# EasyEDA Pro project modular_design.eprj, board log
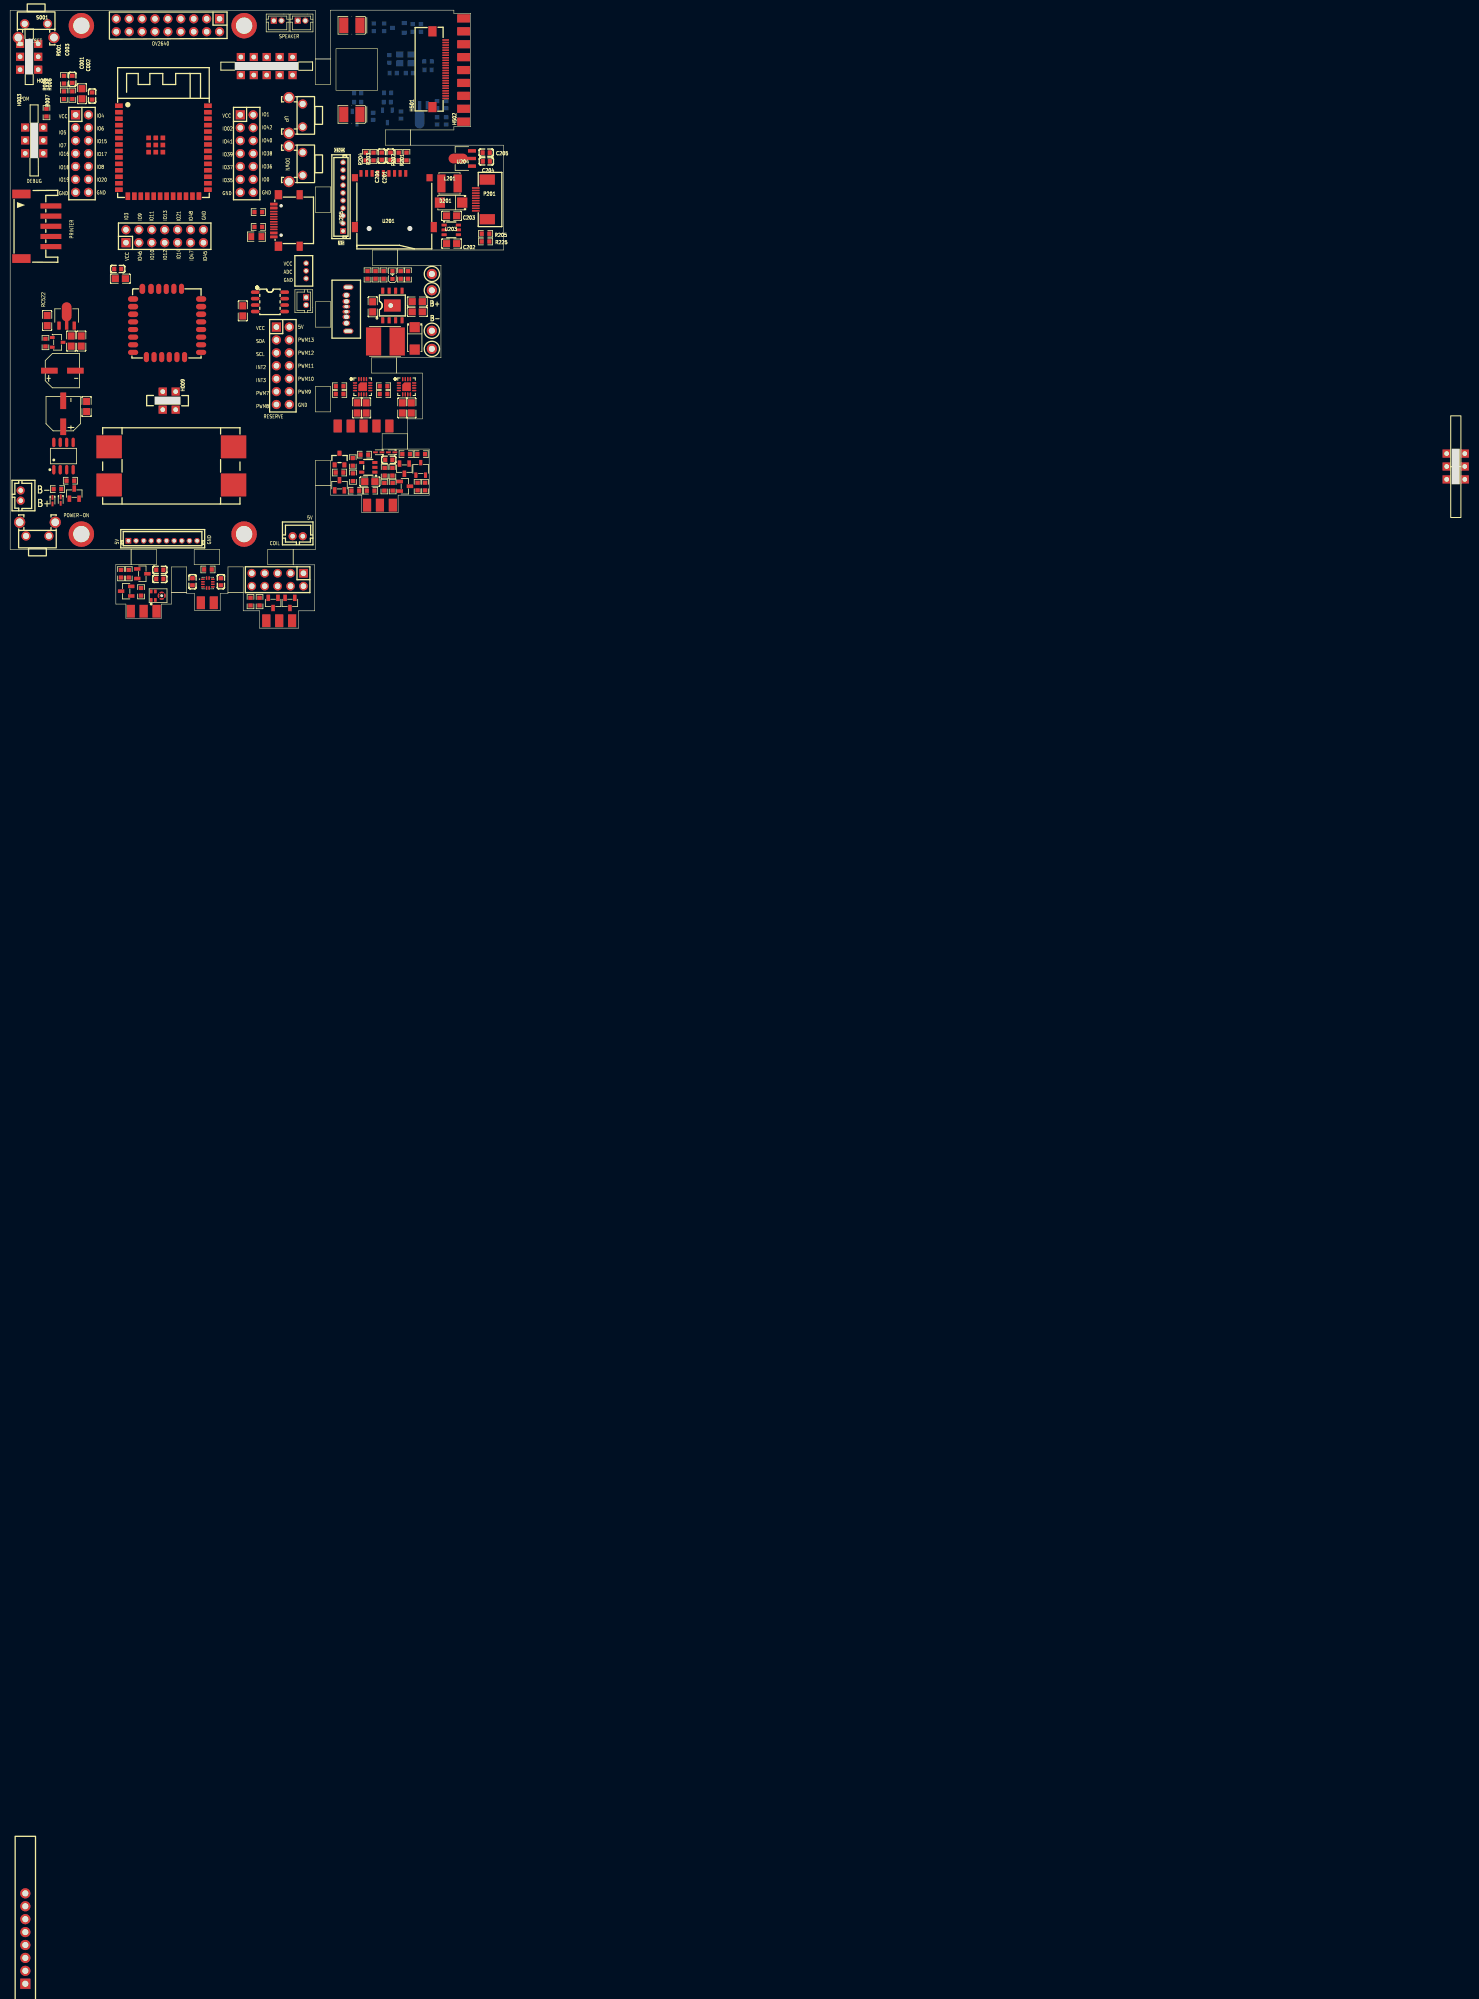
[diagram p9: board, top side]
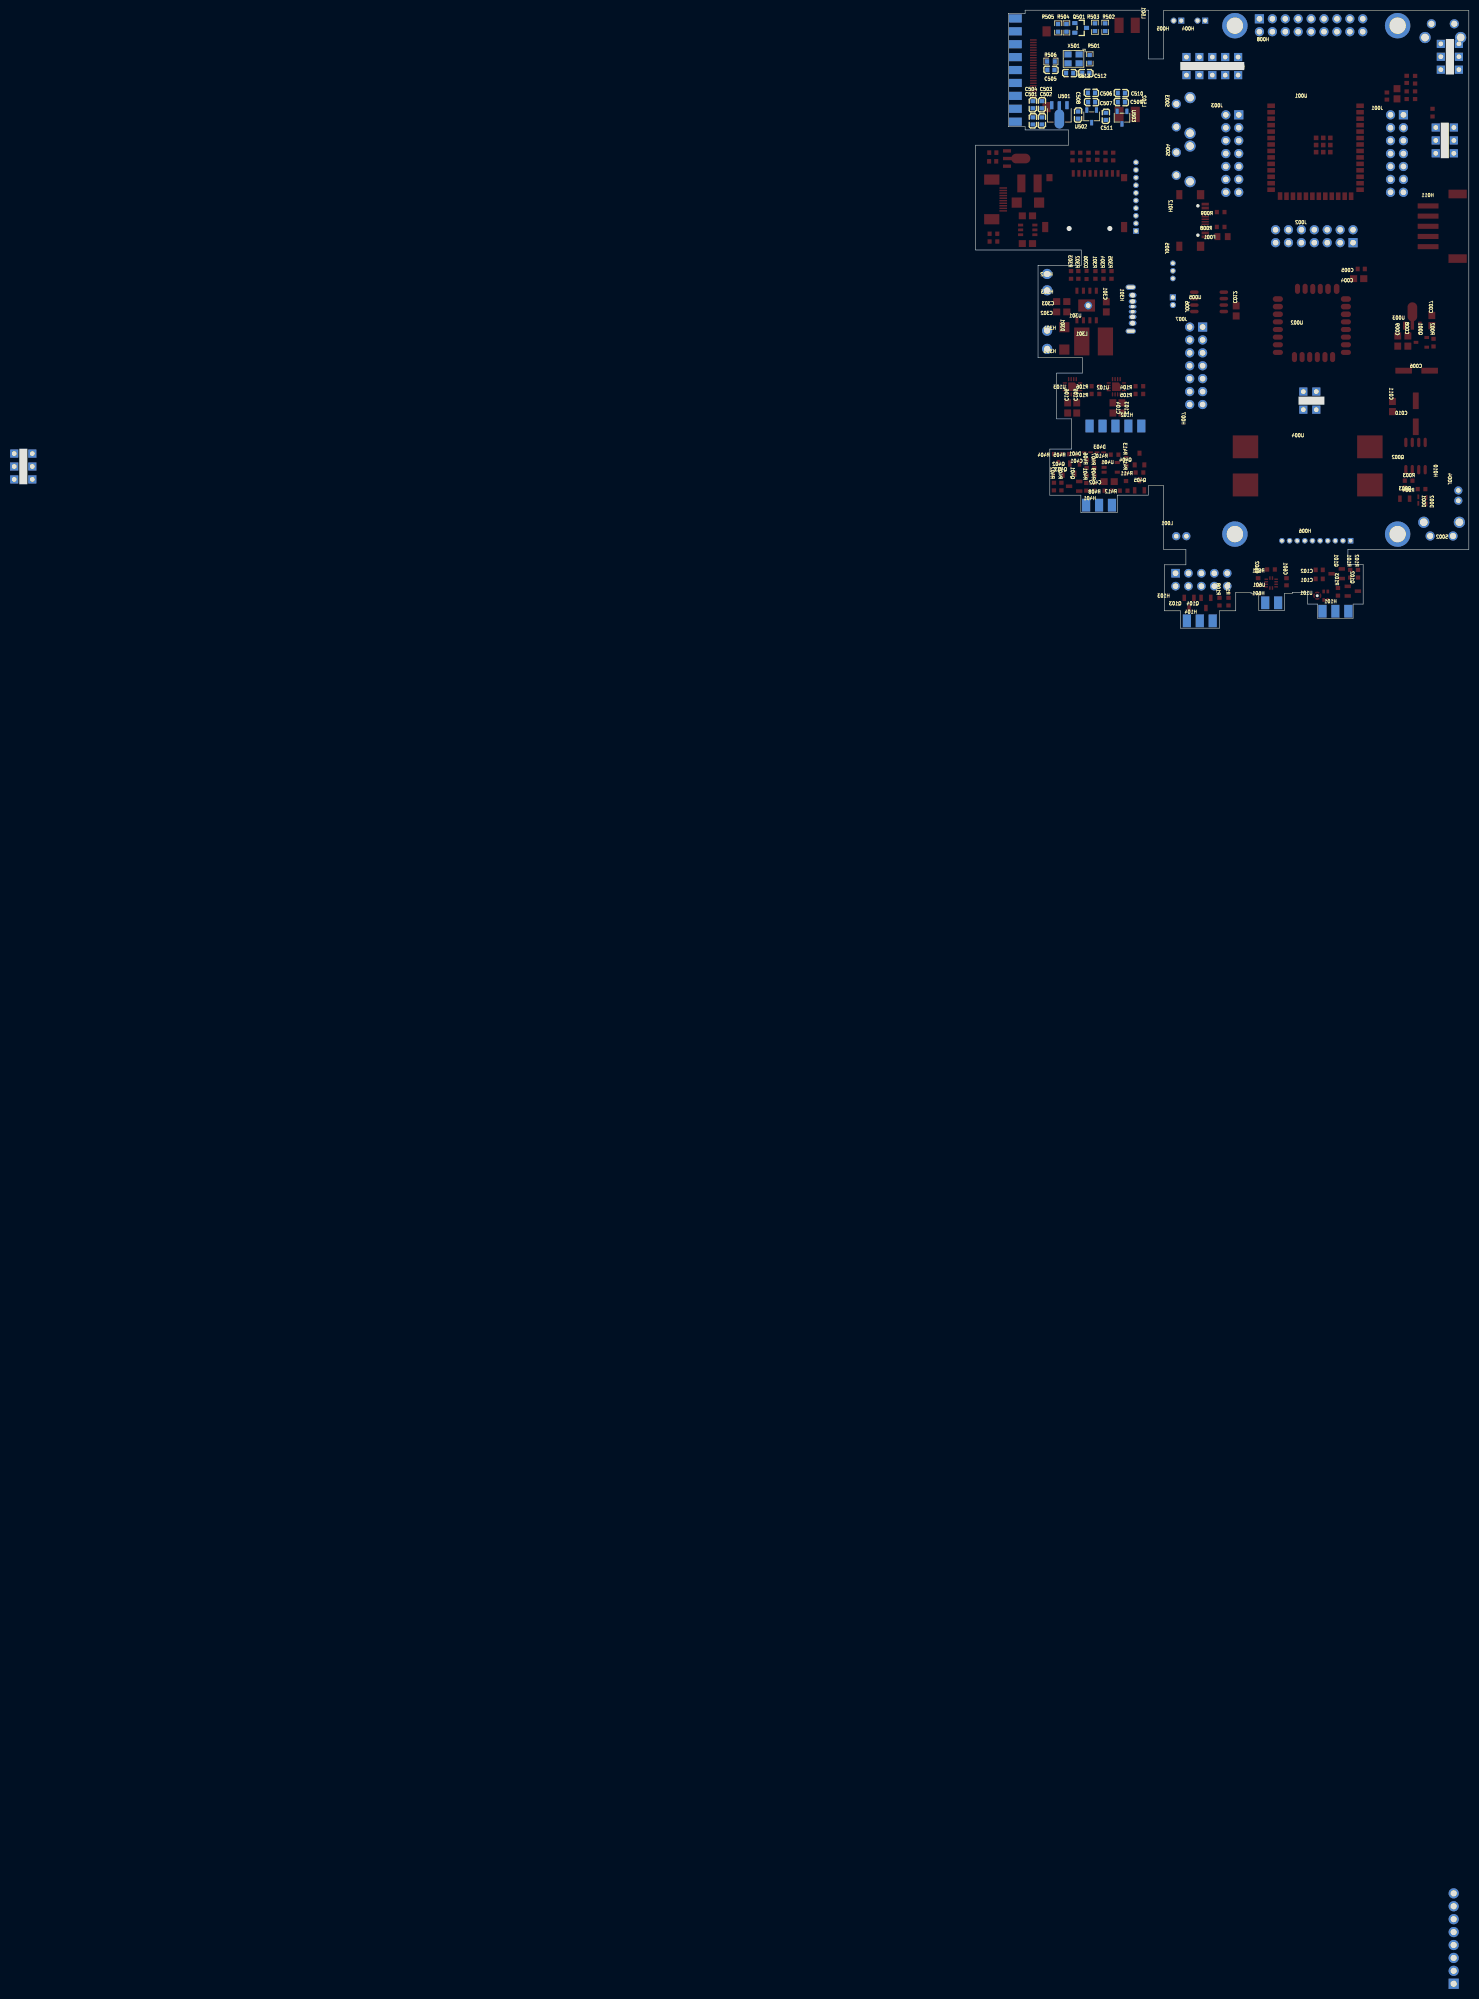
[diagram p10: board, bottom side, seen from below]

Outline 285.05 x 121.54 mm; copper layers: Top Layer, Bottom Layer. Coordinates in mm from the lower left corner of the outline.
Outline path: 0,121.49 60,121.49 60,111.94 62.99,111.94 62.99,121.52 63.01,121.54 87.25,121.54 87.25,120.91 90.56,120.91 90.56,98.63 87.25,98.63 87.25,97.99 78.76,97.99 78.76,94.99 96.99,94.99 96.99,74.37 76.22,74.37 76.22,71.37 84.71,71.37 84.71,53.18 76,53.18 76,50.16 81.05,50.16 81.05,41.15 78.12,41.15 78.12,35.22 82.39,35.22 82.39,26.15 76.29,26.15 76.29,22.75 69.14,22.75 69.14,26.16 63.03,26.16 63.03,28 60.02,28 60.02,15.47 55.64,15.47 55.64,12.45 59.89,12.45 59.89,3.42 59.87,3.4 56.73,3.4 56.73,0 49.04,0 49.04,3.4 45.83,3.4 45.83,7.04 42.83,7.04 42.83,6.84 41.3,6.84 41.3,3.5 36.23,3.5 36.23,6.84 34.71,6.84 34.71,7.04 31.7,7.04 31.7,4.73 29.73,4.73 29.73,1.93 22.76,1.93 22.76,4.73 20.78,4.73 20.78,12.49 23.78,12.49 23.78,15.49 0,15.49 0,121.49
Stack: Top Layer 0.035mm / Dielectric1 1.51mm FR4 er 4.5 / Bottom Layer 0.035mm

## Design rules (mm)
template: 自定义配置
spacing copperThickness1oz (default): track to track 0.102, other pairs 0.05 to 0.3
track width copperThickness1oz (default): min 0.127, default 0.254, max 2.54
track width copperThickness2oz: min 0.203, default 0.254, max 2.54
differential pair differentialPair (default): width min 0.127, default 0.254, max 2.54; gap min 0.152, default 0.152
via viaSize (default): diameter min 0.5, default 0.5, max 10; hole min 0.3, default 0.3, max 6.3

## Placement (name value [footprint] x y rotation side)
C001  10uF  [C0805]  14.12 105.1 90 top
C002  100nF  [C0603]  16.11 104.65 90 top
C003  100nF  [C0603]  12.22 107.93 90 top
C004  10uF  [C0805]  21.66 68.73 0 top
C005  100nF  [C0603]  21.15 70.64 0 top
C006  100uF  [CAP-SMD_BD6.3-L6.6-W6.6-LS7.2-R-RD]  10.26 50.64 180 top
C007  100nF  [C0805]  7.27 60.49 90 top
C008  10uF  [C0805]  11.99 56.46 90 top
C009  100nF  [C0805]  13.98 56.46 90 top
C010  100uF  [CAP-SMD_BD6.3-L6.6-W6.6-LS7.2-R-RD]  10.43 42.16 270 top
C011  100nF  [C0805]  15.02 43.58 270 top
C012  10uF  [C0805]  45.75 62.4 90 top
C101  -  [C0603]  29.42 9.68 180 top
C102  100nF  [C0603]  29.42 11.46 180 top
C103  100nF  [C0805]  68.22 43.31 90 top
C104  -  [C0805]  70 43.31 90 top
C105  100nF  [C0805]  77.11 43.31 90 top
C106  -  [C0805]  78.89 43.31 90 top
C201  -  [C0603]  74.79 92.81 270 top
C202  -  [C0805]  86.8 75.64 0 top
C203  -  [C0805]  86.8 81.09 0 top
C204  -  [C0603]  93.63 91.81 180 top
C205  -  [C0603]  93.61 93.52 180 top
C206  100nF  [C0603]  73.07 92.81 270 top
C301  10uF  [C0805]  71.29 63.19 90 top
C302  22uF  [C0805]  80.05 62.19 0 top
C303  100uF  [C0805]  80.05 64.23 0 top
C401  1uF  [C0603]  74.45 33.1 0 top
C402  -  [C0805]  70.73 28.82 180 top
C501  100nF  [C0603]  85.73 99.77 270 bottom
C502  10uF  [C0603]  83.95 99.77 270 bottom
C503  10uF  [C0603]  83.95 102.94 90 bottom
C504  100nF  [C0603]  85.73 102.94 90 bottom
C505  -  [C0603]  82.17 109.8 0 bottom
C506  -  [C0603]  74.21 105.29 180 bottom
C507  -  [C0603]  74.17 103.45 180 bottom
C508  -  [C0603]  76.84 100.91 270 bottom
C509  10UF  [C0603]  68.33 103.45 180 bottom
C510  -  [C0603]  68.33 105.23 180 bottom
C511  -  [C0603]  71.38 100.66 270 bottom
C512  100nF  [C0603]  75.32 109.17 0 bottom
C513  20pF  [C0603]  78.49 109.17 0 bottom
C601  104  [C0603]  35.85 9.12 270 top
C602  104  [C0603]  41.44 9.12 270 top
D001  1N4148WT  [SOD-523_L1.2-W0.8-LS1.6-RD]  9.93 25.19 270 top
D002  1N4148WT  [SOD-523_L1.2-W0.8-LS1.6-RD]  8.32 25.06 270 top
D201  SS14  [SMA_L4.3-W2.6-LS5.2-RD]  86.7 83.69 180 top
D206  LED_0603-R  [LED_0603]  75.16 69.52 90 top
D301  SS34A  [SMA_L4.3-W2.6-LS5.2-RD]  79.55 56.99 270 top
D401  1N4148WT  [SOD-523_L1.2-W0.8-LS1.6-RD]  75.01 34.58 180 top
D403  1N4148WT  [SOD-523_L1.2-W0.8-LS1.6-RD]  72.46 34.58 180 top
F001  -  [R0805]  48.41 77 0 top
H001  PZ254V-12-6P  [PDM_MODULE]  4.73 108.88 180 top
H002  -  [I2S_HT517_STEREO]  50.45 110.53 90 top
H003  PZ254V-12-6P  [CH343_DEBUG]  4.73 95.92 0 top
H004  B2B-ZR(LF)(SN)  [CONN-TH_B2B-ZR-LF-SN]  52.6 119.48 180 top
H005  B2B-ZR(LF)(SN)  [CONN-TH_B2B-ZR-LF-SN]  57.3 119.48 180 top
H006  -  [connector_p10_1.5mm]  30 17.18 0 top
H007  -  [Metal_Detect]  55.78 31.79 180 top
H008  -  [connector_p2*9_2.54]  30 118.57 180 top
H009  A2541HWV-2x2P  [SC7A20_MODULE]  30 44.74 270 top
H010  -  [RFID_RC522]  4.98 29.76 90 top
H011  HX20007-5AWB  [CONN-SMD_5P-P2.00_HX20007-5AWB]  5.11 79.03 270 top
H012  TYPEC-304S-ACP16  [USB-C-SMD_TYPEC-304S-ACP16]  54.38 80.18 90 top
H101  PZ254V-12-6P  [Finger_2*3]  23.7 3.33 0 top
H102  -  [Finger_2*5]  66.95 39.76 0 top
H103  MTP125-1205S1  [HDR-TH_10P-P2.54-V-M-R2-C5-S2.54]  52.59 9.53 180 top
H104  PZ254V-12-6P  [Finger_2*3]  50.36 1.45 0 top
H301  -  [typec-31-e-11]  66.09 62.73 90 top
H302  -  [Single_Pin]  82.92 69.66 0 top
H303  -  [Single_Pin]  82.92 66.44 0 top
H304  -  [Single_Pin]  82.92 58.49 0 top
H305  -  [Single_Pin]  82.92 54.92 0 top
H401  PZ254V-12-6P  [Finger_2*3]  70.17 24.19 0 top
H501  AFC01-S24FCA-00  [FPC-SMD_P0.50-24P_FGS-XJ-H2.0]  84.33 109.93 90 top
H502  -  [Finger_2*9]  89.16 104.69 90 top
H601  A2541HWV-2x2P  [Finger_2*2]  37.5 4.98 0 top
J001  2.54-2*7P母  [HDR-TH_14P-P2.54-V-F-R2-C7-S2.54-1]  14.13 93.34 270 top
J002  2.54-2*7P母  [HDR-TH_14P-P2.54-V-F-R2-C7-S2.54-1]  30.39 77.08 0 top
J003  2.54-2*7P母  [HDR-TH_14P-P2.54-V-F-R2-C7-S2.54-1]  46.51 93.34 270 top
J004  B2B-ZR(LF)(SN)  [connector_p2_2.0mm]  2.06 26.07 270 top
J005  -  [conn-dip-1*3-1.5mm]  58.19 70.27 270 top
J006  B2B-ZR(LF)(SN)  [CONN-TH_B2B-ZR-LF-SN]  58.19 64.3 90 top
J007  2.54-2*7P母  [HDR-TH_14P-P2.54-V-F-R2-C7-S2.54-1]  53.62 51.6 270 top
L001  -  [connector_p2_2.0mm]  56.54 18.07 0 top
L201  22uH  [IND-SMD_L4.0-W4.0]  86.39 87.47 180 top
L301  -  [IND-SMD_L5.8-W5.2]  73.79 56.38 0 top
L501  暖白3528LED灯珠  [LED-SMD_L3.6-W2.9-R-RD]  67.19 118.56 180 top
L502  暖白3528LED灯珠  [LED-SMD_L3.6-W2.9-R-RD]  67.19 101.04 180 top
NOREF  -  [Pad_e2609]  74.83 63.45 90 top
NOREF#2  -  [Pad_e164]  46 18.49 90 top
NOREF#3  -  [Pad_e162]  46 118.49 180 top
NOREF#4  -  [Pad_e160]  14 118.49 0 top
NOREF#5  -  [Pad_e163]  14 18.49 0 top
P201  0.5-10P上接  [FPC_0.5_10P_mirror]  93.81 84.3 90 top
Q001  SS8550  [SOT-23-3_L2.9-W1.4-P1.90-LS2.6-BR]  9.34 56.21 180 top
Q002  AO4407C  [SOP-8_L4.9-W3.9-P1.27-LS6.0-BL]  10.48 33.84 0 top
Q003  SS8050  [SOT-23-3_L2.9-W1.3-P1.90-LS2.4-BR]  12.6 26.46 270 top
Q101  AO3407  [SOT-23-3_L2.9-W1.3-P1.90-LS2.4-BR]  25.99 10.7 180 top
Q102  SS8050  [SOT-23-3_L2.9-W1.3-P1.90-LS2.4-BR]  22.81 7.27 0 top
Q103  SS8050  [SOT-23-3_L2.9-W1.3-P1.90-LS2.4-BR]  55.01 4.95 90 top
Q104  SS8050  [SOT-23-3_L2.9-W1.3-P1.90-LS2.4-BR]  51.7 4.95 90 top
Q401  MMBT3904  [SOT-23-3_L2.9-W1.3-P1.90-LS2.4-BR]  77.61 27.9 180 top
Q402  MMBT3906-7-F  [SOT-23-3_L2.9-W1.6-P1.90-LS2.8-BR]  80.72 31.32 270 top
Q403  AO3402A  [SOT-23-3_L2.9-W1.3-P1.90-LS2.4-BR]  77.51 31.37 90 top
Q404  AO3401A  [SOT-23_L2.9-W1.3-P1.90-LS2.4-BR]  64.76 33.25 270 top
Q405  MMBT3904  [SOT-23-3_L2.9-W1.3-P1.90-LS2.4-BR]  64.76 28.1 270 top
Q501  AO3404A  [SOT-23_L2.9-W1.3-P1.90-LS2.4-BR]  76.33 118.06 0 bottom
R001  10K  [R0603]  10.57 107.86 270 top
R002  -  [R0603]  6.94 56.16 90 top
R003  10K  [R0603]  11.84 29 180 top
R004  -  [R0603]  9.3 27.34 180 top
R005  10K  [R0603]  10.57 104.81 90 top
R006  10K  [R0603]  12.22 104.81 90 top
R007  10K  [R0603]  7.14 101.39 90 top
R008  -  [R0603]  48.8 78.91 0 top
R009  -  [R0603]  48.8 81.83 0 top
R101  10K  [R0603]  23.32 10.7 270 top
R102  10R  [R0603]  21.8 10.7 90 top
R103  1K  [R0603]  25.73 7.14 90 top
R104  NC  [R0603]  64.79 47.58 180 top
R105  NC  [R0603]  64.79 46.05 180 top
R106  NC  [R0603]  73.42 47.58 180 top
R107  NC  [R0603]  73.42 46.05 180 top
R108  -  [R0603]  49.04 5.21 270 top
R109  -  [R0603]  47.26 5.21 270 top
R201  10K  [R0603]  77.93 92.76 270 top
R202  10K  [R0603]  76.41 92.76 90 top
R203  10K  [R0603]  71.45 92.76 90 top
R204  10K  [R0603]  69.93 92.76 90 top
R205  -  [R0603]  93.48 77.57 180 top
R225  -  [R0603]  93.48 76.04 180 top
R301  1K  [R0603]  73.43 69.47 270 top
R302  10K  [R0603]  76.8 69.47 270 top
R303  10K  [R0603]  78.22 69.47 270 top
R304  -  [R0603]  71.85 69.47 270 top
R305  -  [R0603]  70.27 69.47 270 top
R401  -  [R0603]  75.22 27.8 90 top
R402  -  [R0603]  81.59 27.85 90 top
R403  -  [R0603]  80.11 27.85 90 top
R404  -  [R0603]  80.83 34.22 0 top
R405  -  [R0603]  77.87 34.22 0 top
R406  -  [R0603]  73.64 30.76 90 top
R407  -  [R0603]  75.17 30.76 270 top
R408  -  [R0603]  70.88 27.03 0 top
R409  -  [R0603]  73.58 27.8 270 top
R410  -  [R0603]  69.66 34.12 0 top
R411  10K  [R0603]  64.76 30.6 180 top
R412  -  [R0603]  67.87 27.03 180 top
R413  -  [R0603]  67.36 32.69 90 top
R414  -  [R0603]  67.41 29.68 90 top
R501  1K  [R0603]  74.55 111.96 270 bottom
R502  -  [R0603]  71.51 118.18 90 bottom
R503  -  [R0603]  73.54 118.18 270 bottom
R504  -  [R0603]  79.13 118.06 90 bottom
R505  -  [R0603]  80.78 118.06 270 bottom
R506  -  [R0603]  82.17 111.45 180 bottom
R601  -  [R0603]  38.9 11.53 180 top
S001  TC-1102N-C-A-B  [SW-TH_TC-1102N-C-A-B]  5.11 117.51 180 top
S002  TC-1102N-C-A-B  [SW-TH_TC-1102N-C-A-B]  5.36 19.47 0 top
S003  TC-1102N-C-A-B  [SW-TH_TC-1102N-C-A-B]  56.17 100.84 90 top
S004  TC-1102N-C-A-B  [SW-TH_TC-1102N-C-A-B]  56.17 91.32 90 top
U001  -  [ESP32-S3-WROOM-1U]  30.26 93.85 0 top
U002  -  [GPBA02B-C]  32.03 59.73 0 top
U003  ME6206A33PG  [SOT-89-3_L4.5-W2.5-P1.50-LS4.2-BR]  11.1 60.85 270 top
U004  -  [CX8823_MO]  18.19 39.41 0 top
U005  -  [sop-8_l5.0-w4.0-p1.27-ls6.2-bl]  51.08 64.17 270 top
U101  -  [SD18OB261-104]  28.4 6.38 0 top
U102  HT517  [QFN-16_L3.0-W3.0-P0.50-TL-EP1.7]  69.31 47.48 0 top
U103  HT517  [QFN-16_L3.0-W3.0-P0.50-TL-EP1.7]  77.94 47.48 0 top
U201  -  [TF-01A]  75.54 82.27 0 top
U203  MT9201  [SOT-23-6_L2.9-W1.6-P0.95-LS2.8-BR]  86.74 78.33 180 top
U204  ME6206A33PG  [SOT-89-3_L4.5-W2.5-P1.50-LS4.2-BR]  89.45 92.36 0 top
U205  -  [connector_p10_1.5mm]  65.46 84.86 90 top
U301  CS5095E  [ESOP-8_L4.9-W3.9-P1.27-LS6.0-BL-EP]  75.16 63.45 0 top
U401  LM321-TR  [SOT-23-5_L3.0-W1.7-P0.95-LS2.8-BR]  70.42 31.62 0 top
U501  ME6206A33PG  [SOT-89-3_L4.5-W2.5-P1.50-LS4.2-BR]  80.52 101.49 90 bottom
U502  XC6206-2.8V  [SOT-23-3_L2.9-W1.6-P1.90-LS2.8-BR]  74.17 100.66 90 bottom
U503  XC6206-1.2V  [SOT-23-3_L2.9-W1.6-P1.90-LS2.8-BR]  68.2 100.4 90 bottom
U601  -  [LGA-12_L2.0-W2.0-P0.50-TL]  38.9 8.87 0 top
X501  24MHz  [OSC-SMD_4P-L3.2-W2.5-BL]  77.73 111.96 0 bottom

## Footprints (pads in the part's own frame, mm; a bottom-side part is the same pattern mirrored in y, then rotated)
C0603
  rect 0.8x0.9 smd: 1(-0.7,0) 2(0.7,0)
C0805
  rect 1.41x1.35 smd: 1(-1,0) 2(1,0)
CAP-SMD_BD6.3-L6.6-W6.6-LS7.2-R-RD
  rect 3.26x1.15 smd: 1(2.555,0) 2(-2.555,0)
CH343_DEBUG
  rect 1.6x1.6 hole 0.914: 1(-1.778,2.54) 2(1.778,2.54) 3(-1.778,0) 4(1.778,0) 5(-1.778,-2.54) 6(1.778,-2.54)
conn-dip-1*3-1.5mm
  round 1.1 hole 0.701: 1(-1.498,0) 2(0,0) 3(1.498,0)
CONN-SMD_5P-P2.00_HX20007-5AWB
  rect 1.001x4.099 smd: 1(-4,2.901) 2(-1.999,2.901) 3(0,2.901) 4(1.999,2.901) 5(4,2.901)
  rect 1.7x3.599 smd: 6(6.35,-2.901) 7(-6.35,-2.901)
CONN-TH_B2B-ZR-LF-SN
  rect 1.2x1.2 hole 0.8: 1(0.75,0.001)
  round 1.2 hole 0.8: 2(-0.75,-0.001)
connector_p2*9_2.54
  rect 1.801x1.801 hole 1.1: 1(-11.176,-1.27)
  round 1.801 hole 1.1: 2(-11.176,1.27) 3(-8.636,-1.27) 4(-8.636,1.27) 5(-6.096,-1.27) 6(-6.096,1.27) 7(-3.556,-1.27) 8(-3.556,1.27) 9(-1.016,-1.27) 10(-1.016,1.27) 11(1.524,-1.27) 12(1.524,1.27) 13(4.064,-1.27) 14(4.064,1.27) 15(6.604,-1.27) 16(6.604,1.27) 17(9.144,-1.27) 18(9.144,1.27)
connector_p2_2.0mm
  round 1.6 hole 0.899: 1(1.001,0.004) 2(-1.001,0.004)
connector_p10_1.5mm
  rect 1.1x1.1 hole 0.701: 1(-6.749,0.001)
  round 1.1 hole 0.701: 2(-5.25,0.001) 3(-3.749,0.001) 4(-2.251,0.001) 5(-0.75,0.001) 6(0.75,0.001) 7(2.251,0.001) 8(3.749,0.001) 9(5.25,0.001) 10(6.752,0.001)
CX8823_MO
  rect 5x4.5 smd: 1(1.27,-3.75) 2(25.73,-3.75) 3(1.27,-11.25) 4(25.73,-11.25)
ESOP-8_L4.9-W3.9-P1.27-LS6.0-BL-EP
  rect 0.6x1.2 smd: 1(-1.905,-2.909) 2(-0.635,-2.909) 3(0.635,-2.909) 4(1.905,-2.909) 5(1.905,2.909) 6(0.635,2.909) 7(-0.635,2.909) 8(-1.905,2.909)
  rect 3.3x2.4 smd: 9(0,0)
ESP32-S3-WROOM-1U
  rect 1.5x0.9 smd: 1(-8.877,8.895) 2(-8.877,7.625) 3(-8.877,6.355) 4(-8.877,5.085) 5(-8.877,3.815) 6(-8.877,2.545) 7(-8.877,1.275) 8(-8.877,0.005) 9(-8.877,-1.265) 10(-8.877,-2.535) 11(-8.877,-3.805) 12(-8.877,-5.075) 13(-8.877,-6.345) 14(-8.877,-7.615) 27(8.623,-7.615) 28(8.623,-6.345) 29(8.623,-5.075) 30(8.623,-3.805) 31(8.623,-2.535) 32(8.623,-1.265) 33(8.623,0.005) 34(8.623,1.275) 35(8.623,2.545) 36(8.623,3.815) 37(8.623,5.085) 38(8.623,6.355) 39(8.623,7.625) 40(8.623,8.895)
  rect 0.9x1.5 smd: 15(-7.112,-8.895) 16(-5.842,-8.895) 17(-4.572,-8.895) 18(-3.302,-8.895) 19(-2.032,-8.895) 20(-0.762,-8.895) 21(0.508,-8.895) 22(1.778,-8.895) 23(3.048,-8.895) 24(4.318,-8.895) 25(5.588,-8.895) 26(6.858,-8.865)
  rect 0.9x0.9 smd: 41(-3.027,2.575) 41(-3.027,1.175) 41(-3.027,-0.225) 41(-1.627,2.575) 41(-1.627,1.175) 41(-1.627,-0.225) 41(-0.227,2.575) 41(-0.227,1.175) 41(-0.227,-0.225)
Finger_2*2
  rect 1.6x2.5 smd: 1(0,0.006) 3(2.54,0.006)
  rect 1.6x2.5 smd far side: 2(0,0) 4(2.54,0)
Finger_2*3
  rect 1.6x2.5 smd: 1(0,0) 3(2.54,0) 5(5.08,0)
  rect 1.6x2.5 smd far side: 2(0,-0.006) 4(2.54,-0.006) 6(5.08,-0.006)
Finger_2*5
  rect 1.6x2.5 smd: 1(-2.54,0.003) 3(0,0.003) 5(2.54,0.003) 7(5.08,0.003) 9(7.62,0.003)
  rect 1.6x2.5 smd far side: 2(-2.54,-0.003) 4(0,-0.003) 6(2.54,-0.003) 8(5.08,-0.003) 10(7.62,-0.003)
Finger_2*9
  rect 1.6x2.5 smd: 1(-5.08,0.006) 3(-2.54,0.006) 5(0,0.006) 7(2.54,0.006) 9(5.08,0.006) 11(7.62,0) 13(10.16,0) 15(12.7,0) 17(15.24,0)
  rect 1.6x2.5 smd far side: 2(-5.08,0) 4(-2.54,0) 6(0,0) 8(2.54,0) 10(5.08,0) 12(7.62,0) 14(10.16,-0.006) 16(12.7,-0.006) 18(15.24,-0.006)
FPC-SMD_P0.50-24P_FGS-XJ-H2.0
  rect 0.3x1.3 smd: 1(-5.748,-1.3) 2(-5.248,-1.3) 3(-4.748,-1.3) 4(-4.248,-1.3) 5(-3.748,-1.3) 6(-3.248,-1.3) 7(-2.748,-1.3) 8(-2.248,-1.3) 9(-1.748,-1.3) 10(-1.248,-1.3) 11(-0.748,-1.3) 12(-0.248,-1.3) 13(0.252,-1.3) 14(0.752,-1.3) 15(1.252,-1.3) 16(1.752,-1.3) 17(2.252,-1.3) 18(2.752,-1.3) 19(3.252,-1.3) 20(3.752,-1.3) 21(4.252,-1.3) 22(4.752,-1.3) 23(5.252,-1.3) 24(5.752,-1.3)
  rect 2x1.6 smd: 25(7.45,1.3) 26(-7.45,1.3)
FPC_0.5_10P_mirror
  rect 0.299x1.501 smd: 1(-2.235,2.25) 2(-1.738,2.25) 3(-1.237,2.25) 4(-0.737,2.25) 5(-0.236,2.25) 6(0.264,2.25) 7(0.764,2.25) 8(1.265,2.25) 9(1.763,2.25) 10(2.263,2.25)
  rect 1.999x2.999 smd: 11(-3.884,-0.011) 12(3.919,-0.005)
GPBA02B-C
  oval 1.1x2 smd: 2(-6.042,6.993) 35(-4.341,6.983)
  oval 2x1.1 smd: 3(-7.862,5.003) 4(-7.862,3.503) 5(-7.862,2.003) 25(5.519,2.003) 26(5.519,3.503) 27(5.519,5.003)
  oval 2x1 smd: 6(-7.862,0.503) 7(-7.862,-0.997) 8(-7.862,-2.497) 9(-7.862,-3.997) 10(-7.862,-5.497) 20(5.519,-5.497) 21(5.519,-3.997) 22(5.519,-2.497) 23(5.519,-0.997) 24(5.519,0.503)
  oval 1x2 smd: 11(-5.242,-6.417) 12(-3.741,-6.417) 13(-2.241,-6.417) 14(-0.742,-6.417) 15(0.758,-6.417) 17(2.259,-6.417) 30(1.659,7.006) 31(0.159,7.003) 32(-1.341,6.973) 33(-2.821,6.983)
HDR-TH_10P-P2.54-V-M-R2-C5-S2.54
  rect 1.7x1.7 hole 1.1: 1(-5.08,-1.27)
  round 1.7 hole 1.1: 2(-5.08,1.27) 3(-2.54,-1.27) 4(-2.54,1.27) 5(0,-1.27) 6(0,1.27) 7(2.54,-1.27) 8(2.54,1.27) 9(5.08,-1.27) 10(5.08,1.27)
HDR-TH_14P-P2.54-V-F-R2-C7-S2.54-1
  rect 1.801x1.801 hole 1.1: 1(-7.62,-1.27)
  round 1.801 hole 1.1: 2(-7.62,1.27) 3(-5.08,-1.27) 4(-5.08,1.27) 5(-2.54,-1.27) 6(-2.54,1.27) 7(0,-1.27) 8(0,1.27) 9(2.54,-1.27) 10(2.54,1.27) 11(5.08,-1.27) 12(5.08,1.27) 13(7.62,-1.27) 14(7.62,1.27)
I2S_HT517_STEREO
  rect 1.6x1.6 hole 0.914: 1(-1.758,5.08) 2(1.798,5.08) 3(-1.758,2.54) 4(1.798,2.54) 5(-1.758,0) 6(1.798,0) 7(-1.758,-2.54) 8(1.798,-2.54) 9(-1.758,-5.08) 10(1.798,-5.08)
IND-SMD_L4.0-W4.0
  rect 1.6x3.5 smd: 1(-1.6,0) 2(1.6,0)
IND-SMD_L5.8-W5.2
  rect 3x5.5 smd: 1(2.325,0) 2(-2.325,0)
LED-SMD_L3.6-W2.9-R-RD
  rect 1.785x3.024 smd: 1(1.593,0) 2(-1.593,0)
LED_0603
  rect 0.8x0.8 smd: 1(-0.851,-0.01) 2(0.75,-0.005)
LGA-12_L2.0-W2.0-P0.50-TL
  rect 0.7x0.28 smd: 1(-1.002,0.75) 2(-1.002,0.25) 3(-1.002,-0.25) 4(-1.002,-0.75) 7(0.949,-0.75) 8(0.949,-0.25) 9(0.949,0.25) 10(0.949,0.75)
  rect 0.28x0.7 smd: 5(-0.277,-0.975) 6(0.224,-0.975) 11(0.224,0.975) 12(-0.277,0.975)
Metal_Detect
  rect 1.6x1.6 hole 0.914: 1(-230.251,2.54) 2(-226.695,2.54) 3(-230.251,0) 4(-226.695,0) 5(-230.251,-2.54) 6(-226.695,-2.54)
OSC-SMD_4P-L3.2-W2.5-BL
  rect 1.4x1.2 smd: 1(-1.1,-0.875) 2(1.1,-0.875) 3(1.1,0.875) 4(-1.1,0.875)
Pad_e160
  round 5 hole 3.2: (0,0)
Pad_e162
  round 5 hole 3.2: (0,0)
Pad_e163
  round 5 hole 3.2: (0,0)
Pad_e164
  round 5 hole 3.2: (0,0)
Pad_e2609
  round 1.524 hole 0.914: 1(0,0)
PDM_MODULE
  rect 1.6x1.6 hole 0.914: 1(-0.778,-0.96) 2(2.778,-0.96) 3(-0.778,-3.5) 4(2.778,-3.5) 5(-0.778,-6.04) 6(2.778,-6.04)
QFN-16_L3.0-W3.0-P0.50-TL-EP1.7
  oval 0.851x0.28 smd: 1(-1.501,0.75) 2(-1.501,0.249) 3(-1.501,-0.249) 4(-1.501,-0.75) 9(1.501,-0.75) 10(1.501,-0.249) 11(1.501,0.249) 12(1.501,0.75)
  oval 0.28x0.851 smd: 5(-0.75,-1.501) 6(-0.249,-1.501) 7(0.249,-1.501) 8(0.75,-1.501) 13(0.75,1.501) 14(0.249,1.501) 15(-0.249,1.501) 16(-0.75,1.501)
  custom 1.702x1.702 smd: 17(0,0)
R0603
  rect 0.806x0.864 smd: 1(-0.753,0) 2(0.753,0)
R0805
  rect 1.133x1.377 smd: 1(-1,0) 2(1,0)
RFID_RC522
  rect 2x2 hole 1.2: 1(-296.393,2)
  round 2 hole 1.2: 2(-293.853,2) 3(-291.313,2) 4(-288.773,2) 5(-286.233,2) 6(-283.693,2) 7(-281.153,2) 8(-278.613,2)
SC7A20_MODULE
  rect 1.6x1.6 hole 0.914: 1(-1.778,2.54) 2(1.778,2.54) 3(-1.778,0) 4(1.778,0)
SD18OB261-104
  rect 0.52x0.73 smd: 1(-0.673,-0.835) 2(0.146,-0.835) 4(0.146,0.835) 5(-0.673,0.835)
Single_Pin
  round 2 hole 1.2: 1(0,0)
SMA_L4.3-W2.6-LS5.2-RD
  rect 2x2 smd: 1(-2.2,0) 2(2.2,0)
SOD-523_L1.2-W0.8-LS1.6-RD
  rect 0.93x0.36 smd: 1(-0.635,0) 2(0.635,0)
SOP-8_L4.9-W3.9-P1.27-LS6.0-BL
  oval 0.63x1.865 smd: 1(-1.905,-2.683) 2(-0.635,-2.683) 3(0.635,-2.683) 4(1.905,-2.683) 5(1.905,2.683) 6(0.635,2.683) 7(-0.635,2.683) 8(-1.905,2.683)
sop-8_l5.0-w4.0-p1.27-ls6.2-bl
  oval 0.701x1.7 smd: 1(-1.905,-2.901) 2(-0.635,-2.901) 3(0.635,-2.901) 4(1.905,-2.901) 5(1.905,2.901) 6(0.635,2.901) 7(-0.635,2.901) 8(-1.905,2.901)
SOT-23-3_L2.9-W1.3-P1.90-LS2.4-BR
  rect 1.25x0.7 smd: 1(1,-0.95) 2(1,0.95) 3(-1,0)
SOT-23-3_L2.9-W1.4-P1.90-LS2.6-BR
  rect 0.91x0.6 smd: 1(1.055,-0.955) 2(1.055,0.955) 3(-1.055,0)
SOT-23-3_L2.9-W1.6-P1.90-LS2.8-BR
  rect 1.07x0.6 smd: 1(1.235,-0.95) 2(1.235,0.95) 3(-1.235,0)
SOT-23-5_L3.0-W1.7-P0.95-LS2.8-BR
  rect 1x0.6 smd: 1(1.3,-0.95) 2(1.3,0) 3(1.3,0.95) 4(-1.3,0.95) 5(-1.3,-0.95)
SOT-23-6_L2.9-W1.6-P0.95-LS2.8-BR
  rect 1x0.55 smd: 1(1.4,-0.95) 2(1.4,0) 3(1.4,0.95) 4(-1.4,0.95) 5(-1.4,0) 6(-1.4,-0.95)
SOT-23_L2.9-W1.3-P1.90-LS2.4-BR
  rect 1x0.8 smd: 1(1.15,-0.95) 2(1.15,0.95) 3(-1.15,0)
SOT-89-3_L4.5-W2.5-P1.50-LS4.2-BR
  rect 1.575x0.672 smd: 1(1.356,-1.5) 3(1.356,1.5)
  custom 5.377x1.9 smd: 2(-1.356,0)
SW-TH_TC-1102N-C-A-B
  round 1.801 hole 1.199: 1(-2.251,-1.349) 2(2.251,-1.349)
  round 2.2 hole 1.501: 3(-3.5,1.351) 4(3.5,1.351)
TF-01A
  rect 0.6x1.3 smd: 1(2.24,7.165) 2(1.141,7.165) 3(0.041,7.165) 4(-1.059,7.165) 5(-2.159,7.165) 6(-3.259,7.165) 7(-4.359,7.165) 8(-5.458,7.165) 9(-6.559,7.165)
  rect 1.199x1.399 smd: 10(-7.76,6.314) 13(6.921,6.314)
  rect 1.199x1.999 smd: 11(-7.76,-3.389) 12(7.76,-3.389)
typec-31-e-11
  oval 1.001x1.501 hole 0.914x0.96: 1(-2.751,-0.029) 6(2.748,-0.029)
  oval 0.899x1.501 hole 0.8x0.96: 2(-1.522,-0.029) 5(1.519,-0.029)
  oval 0.711x1.501 hole 0.6x0.8: 3(-0.5,-0.029) 4(0.5,-0.029)
  oval 1.001x1.999 hole 0.6x1.6: 7(-4.321,-0.4) 8(4.321,-0.4)
USB-C-SMD_TYPEC-304S-ACP16
  rect 1.8x1.45 smd: 13(-5.07,1.633) 14(5.07,1.633)
  rect 1.8x1.2 smd: 15(-5.07,-2.547) 16(5.07,-2.547)
  rect 0.55x1.45 smd: A1B12(-3.225,2.547) A4B9(-2.45,2.547) B1A12(3.22,2.547) B4A9(2.45,2.547)
  rect 0.3x1.45 smd: A5(-1.26,2.533) A6(-0.25,2.547) A7(0.25,2.547) A8(1.25,2.547) B5(1.75,2.547) B6(0.75,2.547) B7(-0.75,2.547) B8(-1.75,2.547)

## Nets
+5V: C006.1 C012.1 F001.1 H002.10 H003.1 H006.1 H007.1 H008.1 H011.5 J007.2 L001.1 Q001.2 R002.1 U004.2 U005.4
+12V: C010.1 C011.2 Q002.5 Q002.6 Q002.7 Q002.8 U004.1
GND: C001.2 C002.2 C003.1 C004.1 C005.1 C006.2 C007.1 C008.1 C009.1 C010.2 C011.1 C012.2 H001.6 H002.9 H003.6 H006.10 H007.6 H008.18 H009.2 H010.6 H011.1 H011.6 H011.7 H012.13 H012.14 H012.15 H012.16 H012.A1B12 H012.B1A12 J001.13 J001.14 J002.14 J003.13 J003.14 J004.2 J005.3 J007.14 Q003.2 R008.1 R009.1 S001.2 S001.3 S001.4 S003.1 S003.3 S003.4 S004.1 S004.3 S004.4 U001.1 U001.40 U001.41 U002.11 U003.1 U004.3 U004.4 U005.3
VCC: C001.1 C002.1 C004.2 C005.2 C008.2 C009.2 H001.2 H009.1 H010.8 J001.1 J002.1 J003.1 J005.1 J007.1 Q001.3 R001.2 R005.2 R006.2 R007.2 U001.2 U002.17 U002.35 U003.3
BTN_DN: S004.2 U002.3
BTN_UP: S003.2 U002.2
CAM_1V2: C509.1 C510.1 H501.10 U503.2
CAM_2V8: C506.1 C507.1 H501.4 U502.2
CAM_3V3: C503.2 C504.2 C505.2 C508.2 C511.2 C512.1 H501.11 R501.2 U501.3 U502.3 U503.3 X501.4
CAM_5V0: C501.2 C502.2 H502.1 L501.1 L502.1 U501.2
CAM_D0: H501.19 H502.13
CAM_D1: H501.21 H502.15
CAM_D2: H501.22 H502.16
CAM_D3: H501.20 H502.14
CAM_D4: H501.18 H502.12
CAM_D5: H501.16 H502.11
CAM_D6: H501.14 H502.10
CAM_D7: H501.12 H502.9
CAM_GND: C501.1 C502.1 C503.1 C504.1 C505.1 C506.2 C507.2 C508.1 C509.2 C510.2 C511.1 C512.2 C513.1 H501.2 H501.15 H501.25 H501.26 H502.18 Q501.2 R504.1 U501.1 U502.1 U503.1 X501.2
CAM_HREF: H501.9 H502.7
CAM_PCLK: H501.17 H502.8
CAM_PWDN: H501.8 H502.5
CAM_RESET: H501.6 H502.3
CAM_SIOC: H501.5 H502.4
CAM_SIOD: H501.3 H502.2
CAM_VSYNC: H501.7 H502.6
CAM_XCLK: H501.13 R506.1
CMA_LIGHT: H502.17 R505.2
DEBUG_3V3: H103.3 H103.4 H103.6
DEBUG_5V0: H103.1 H103.2 H104.1
DEBUG_BOOT: H104.2 Q103.3
DEBUG_DTR: H103.10 Q103.2 R109.1
DEBUG_GND: H103.5 H104.6
DEBUG_RESEST: H104.4 Q104.3
DEBUG_RTS: H103.8 Q104.2 R108.1
DEBUG_RXD: H103.7 H104.3
DEBUG_TXD: H103.9 H104.5
ESP_BOOT: H003.2 H010.1 J003.12 R007.1 U001.27
ESP_IO1: H007.4 J003.2 U001.39
ESP_IO2: H007.5 J003.3 U001.38
ESP_IO3: H008.15 J002.2 U001.15
ESP_IO4: J001.2 J005.2 U001.4
ESP_IO5: H008.2 H009.3 J001.3 J007.3 R006.1 U001.5
ESP_IO6: H008.4 H009.4 J001.4 J007.5 R005.1 U001.6
ESP_IO7: H008.7 J001.5 U001.7
ESP_IO8: H008.13 J001.10 U001.12
ESP_IO9: H008.6 J002.4 U001.17
ESP_IO10: H008.8 J002.5 U001.18
ESP_IO11: H006.2 J002.6 U001.19
ESP_IO12: H006.3 J002.7 U001.20
ESP_IO13: H006.4 J002.8 U001.21
ESP_IO14: H006.5 J002.9 U001.22
ESP_IO15: H008.9 H011.4 J001.6 U001.8
ESP_IO16: H008.10 H011.3 J001.7 U001.9
ESP_IO17: H008.11 H011.2 J001.8 U001.10
ESP_IO18: H008.12 J001.9 U001.11
ESP_IO19: H008.14 H012.A7 H012.B7 J001.11 U001.13
ESP_IO20: H008.16 H012.A6 H012.B6 J001.12 U001.14
ESP_IO21: H006.8 J002.10 U001.23
ESP_IO35: H006.6 J003.11 U001.28
ESP_IO36: H006.7 J003.10 U001.29
ESP_IO37: J003.9 U001.30
ESP_IO38: H002.5 J003.8 U001.31
ESP_IO39: H002.3 J003.7 U001.32
ESP_IO40: H002.1 J003.6 U001.33
ESP_IO41: H001.3 J003.5 U001.34
ESP_IO42: H001.1 J003.4 U001.35
ESP_IO45: H010.2 J002.13 U001.26 U002.31
ESP_IO46: J002.3 U001.16 U002.33
ESP_IO47: H010.4 J002.11 U001.24 U002.32
ESP_IO48: H010.3 J002.12 U001.25 U002.30
ESP_RESET: C003.2 H003.4 R001.1 S001.1 U001.3
ESP_RXD: H003.5 U001.36
ESP_TXD: H003.3 U001.37
HT517_BLCK: H102.1 U102.16 U103.14
HT517_CN1_N: H102.4 U102.10
HT517_CN1_P: H102.2 U102.9
HT517_CN2_N: H102.8 U103.10
HT517_CN2_P: H102.6 U103.9
HT517_DIN: H102.5 U102.1 U103.16
HT517_EN: H102.7 U102.4 U103.4
HT517_GND: C103.1 C104.1 C105.1 C106.1 H102.9 R104.2 R106.2 U102.3 U102.11 U102.15 U102.17 U103.3 U103.11 U103.15 U103.17
HT517_LRCK: H102.3 U102.14 U103.1
HT517_VCC: C103.2 C104.2 C105.2 C106.2 H102.10 R105.2 R107.2 U102.7 U102.8 U103.7 U103.8
I2S_EN: H002.7 U002.12
INT_02: H008.3 J007.7 U002.4
INT_03: H008.5 J007.9 U002.5
LCD_RESET: H006.9 U002.7
METAL_ENABLE: H007.3 U002.13
MIC_CLK: H101.3 U101.4
MIC_DAT: H101.1 U101.1
MIC_EN: H101.5 R103.2
MIC_GND: C101.1 C102.1 H101.6 Q102.2
MIC_VCC: H101.2 Q101.2 R101.2
P0_CMA_LIGHT: H008.17 U002.6
P2_3V3: C201.2 C205.2 C206.2 P201.4 R201.1 R202.2 R203.2 R204.2 R225.1 U201.4 U204.3
P2_5V0: C203.2 C204.2 L201.1 U203.6 U204.2 U205.1
P2_GND: C201.1 C202.1 C203.1 C204.1 C205.1 C206.1 P201.3 P201.10 P201.11 P201.12 R205.1 U201.6 U201.10 U201.11 U201.12 U201.13 U203.2 U204.1 U205.10
P2_LCD_ANODE: C202.2 D201.1 P201.2 U203.5
P2_LCD_CATHODE: P201.1 R205.2 U203.3
P2_LCD_CS: P201.8 U205.8
P2_LCD_RESET: P201.9 U205.9
P2_LCD_RS: P201.5 U205.5
P2_LCD_SCL: P201.7 U205.7
P2_LCD_SDA: P201.6 U205.6
P2_SD_CLK: R203.1 U201.5 U205.3
P2_SD_CMD: R202.1 U201.3 U205.2
P2_SD_DAT: R204.1 U201.7 U205.4
P4_GND: H401.6 Q401.2 Q403.2 Q405.2 R405.1 R409.2 R414.1 U401.2
P4_L_CATHODE: H401.2 Q403.3 R406.1 R407.2
P4_METAL_ADC: H401.4 R413.1 R414.2
P4_METAL_EN: H401.3 R412.1
P4_METAL_PULSE: H401.5 R401.1
P4_VCC: H401.1 Q404.2 R411.1
P6_3V3: C601.1 C602.2 H601.1 U601.3 U601.7 U601.11
P6_GND: C601.2 C602.1 H601.2 R601.1 U601.4 U601.8 U601.9
PDM_EN: H001.5 U002.10
POWER_LOCK: D001.2 U002.14
PWM_07: J007.11 U002.9
PWM_08: J007.13 U002.20
PWM_09: J007.12 U002.21
PWM_010: J007.10 U002.22
PWM_011: J007.8 U002.23
PWM_012: J007.6 U002.24
PWM_013: J007.4 U002.25
PWM_014: U002.26 U005.2
PWM_015: U002.27 U005.1
RC522_IRQ: H010.5 U002.15
RC522_RST: H010.7 U002.8
SC7A20_SCL: H601.4 U601.12
SC7A20_SDA: H601.3 U601.2
SPK1_N: H002.4 H004.2
SPK1_P: H002.2 H004.1
SPK2_N: H002.8 H005.2
SPK2_P: H002.6 H005.1
USB+: C301.1 H301.2 H301.5 L301.2 R301.2 U301.1
USB-: C301.2 C302.2 C303.2 H301.1 H301.6 H301.7 H301.8 H304.1 H305.1 NOREF.1 R302.1 R303.1 R304.1 R305.1 U301.2 U301.9
VBIN: C303.1 H302.1 H303.1 U301.5
$1N5617: C007.2 Q001.1 R002.2 U003.2
$1N9021: H007.2 L001.2
$1N9369: Q002.4 Q003.3 R003.1
$1N9446: Q003.1 R004.1
$1N9668: D001.1 D002.1 R004.2
$1N9696: J004.1 Q002.1 Q002.2 Q002.3 R003.2 S002.1
$1N18392: H012.A5 R008.2
$1N18402: F001.2 H012.A4B9 H012.B4A9
$1N18404: H012.B5 R009.2
$1N20301: J006.1 U005.7 U005.8
$1N20305: J006.2 U005.5 U005.6
$1N20758: D002.2 S002.2
$2N358: C101.2 C102.2 Q101.3 U101.2 U101.5
$2N709: Q101.1 R101.1 R102.2
$2N810: Q102.3 R102.1
$2N897: Q102.1 R103.1
$2N2003: R104.1 R105.1 U102.2
$2N2005: R106.1 R107.1 U103.2
$2N3190: Q103.1 R108.2
$2N3194: Q104.1 R109.2
$3N1120: D201.2 L201.2 U203.1
$3N2623: R225.2 U203.4
$3N5060: R201.2 U201.2
$4N871: Q401.1 R401.2
$4N873: Q401.3 R402.1 R403.1
$4N875: Q402.1 R403.2
$4N877: Q402.3 R404.2
$4N879: Q403.1 R404.1 R405.2
$4N893: C401.2 D401.1 D403.2 R407.1
$4N898: C402.1 R408.2 R409.1 U401.1
$4N903: R410.1 R413.2 U401.4
$4N908: C402.2 D401.2 D403.1 Q402.2 Q404.3 R402.2 R406.2 R408.1 U401.5
$4N926: C401.1 R410.2 U401.3
$4N1398: Q404.1 Q405.3 R411.2
$4N1499: Q405.1 R412.2
$5N399: C302.1 D301.1 U301.4
$5N401: D301.2 L301.1 U301.3
$5N413: D206.2 R301.1
$5N415: D206.1 U301.8
$5N418: R302.2 U301.7
$5N420: R303.2 U301.6
$5N663: H301.3 R304.2
$5N667: H301.4 R305.2
$6N1076: R501.1 X501.1
$6N1779: L501.2 R502.2
$6N1805: L502.2 R503.2
$6N1887: Q501.3 R502.1 R503.1
$6N1935: Q501.1 R504.2 R505.1
$6N2239: C513.2 R506.2 X501.3
$7N310: R601.2 U601.1

Pads without a net: H001 4; H012 A8 B8; H101 4; H501 1 23 24; S002 3 4; U102 5 6 12 13; U103 5 6 12 13; U201 1 8 9; U601 5 6 10

## Text on the board
Top Silkscreen Layer: RESET | VCC | IO5 | IO7 | IO16 | IO18 | IO19 | GND | POWER-ON | IO4 | IO6 | IO15 | IO17 | IO8 | IO20 | OV2640 | IO02 | IO41 | IO39 | IO37 | IO35 | SDA | SCL | INT2 | INT3 | PWM7 | PWM8 | IO1 | IO42 | IO40 | IO38 | IO36 | IO0 | RESERVE | COIL | ADC | 5V | PWM13 | PWM12 | PWM11 | PWM10 | PWM9 | RC522 | PRINTER | IO3 | IO9 | IO46 | IO11 | IO13 | IO12 | IO21 | IO14 | IO48 | IO47 | IO45 | UP | DOWN | PDM | DEBUG | SPEAKER | IO10 | B- | B+
